# Altium project Sinus_Project.PrjPCB
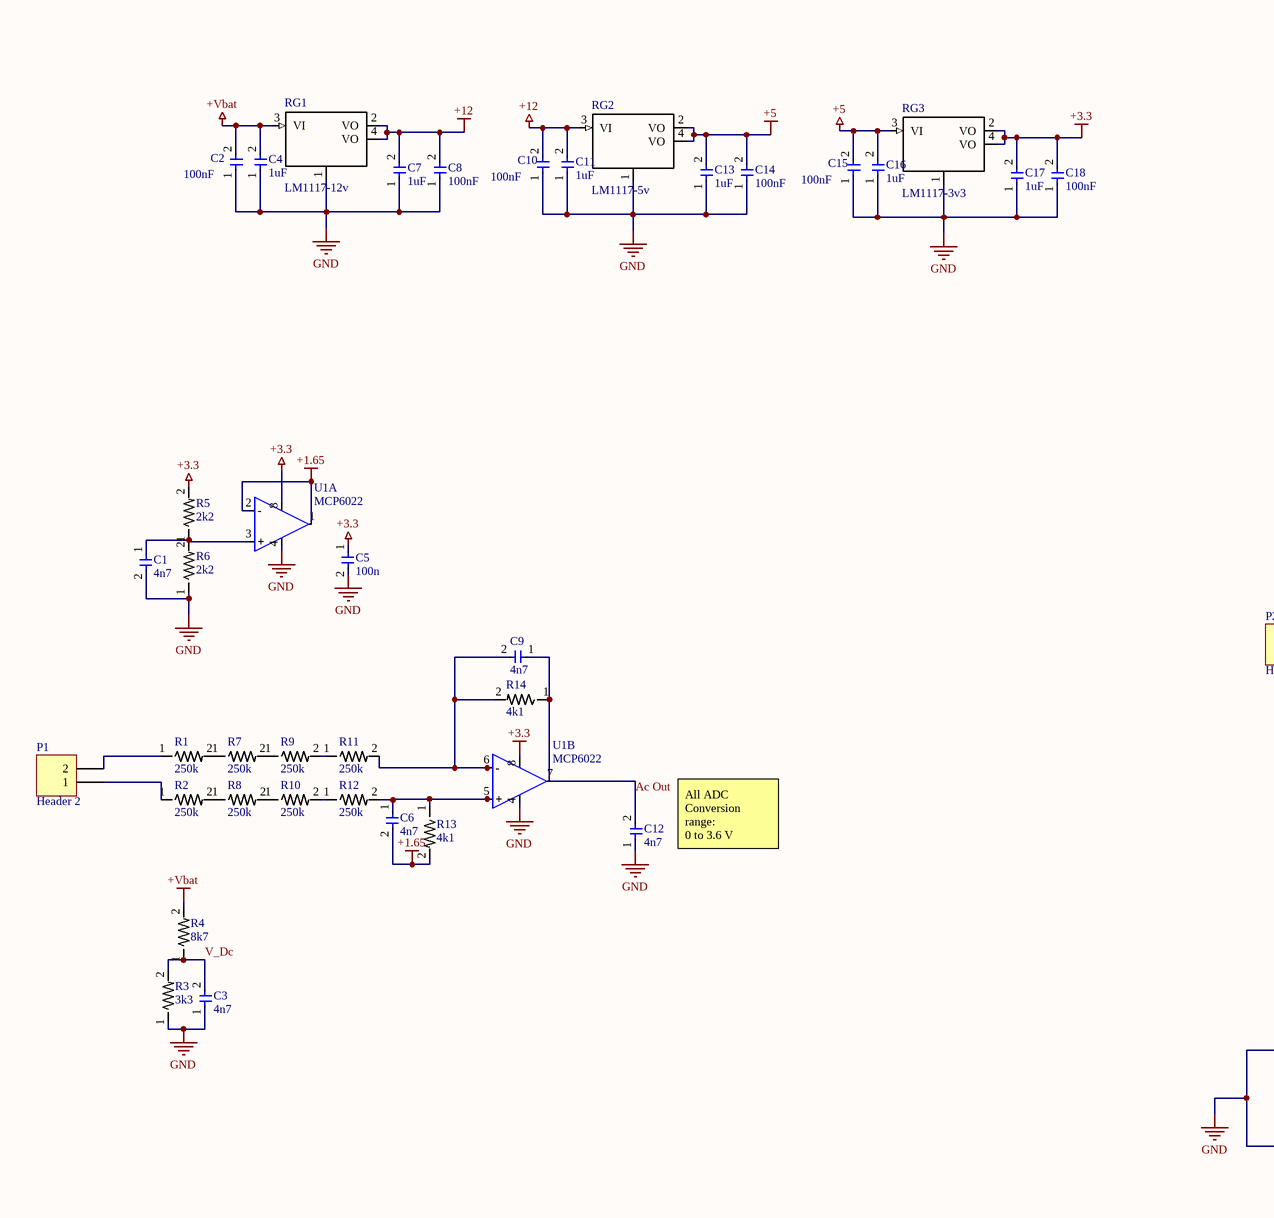
[diagram p0: pure_sinus.SchDoc, left]
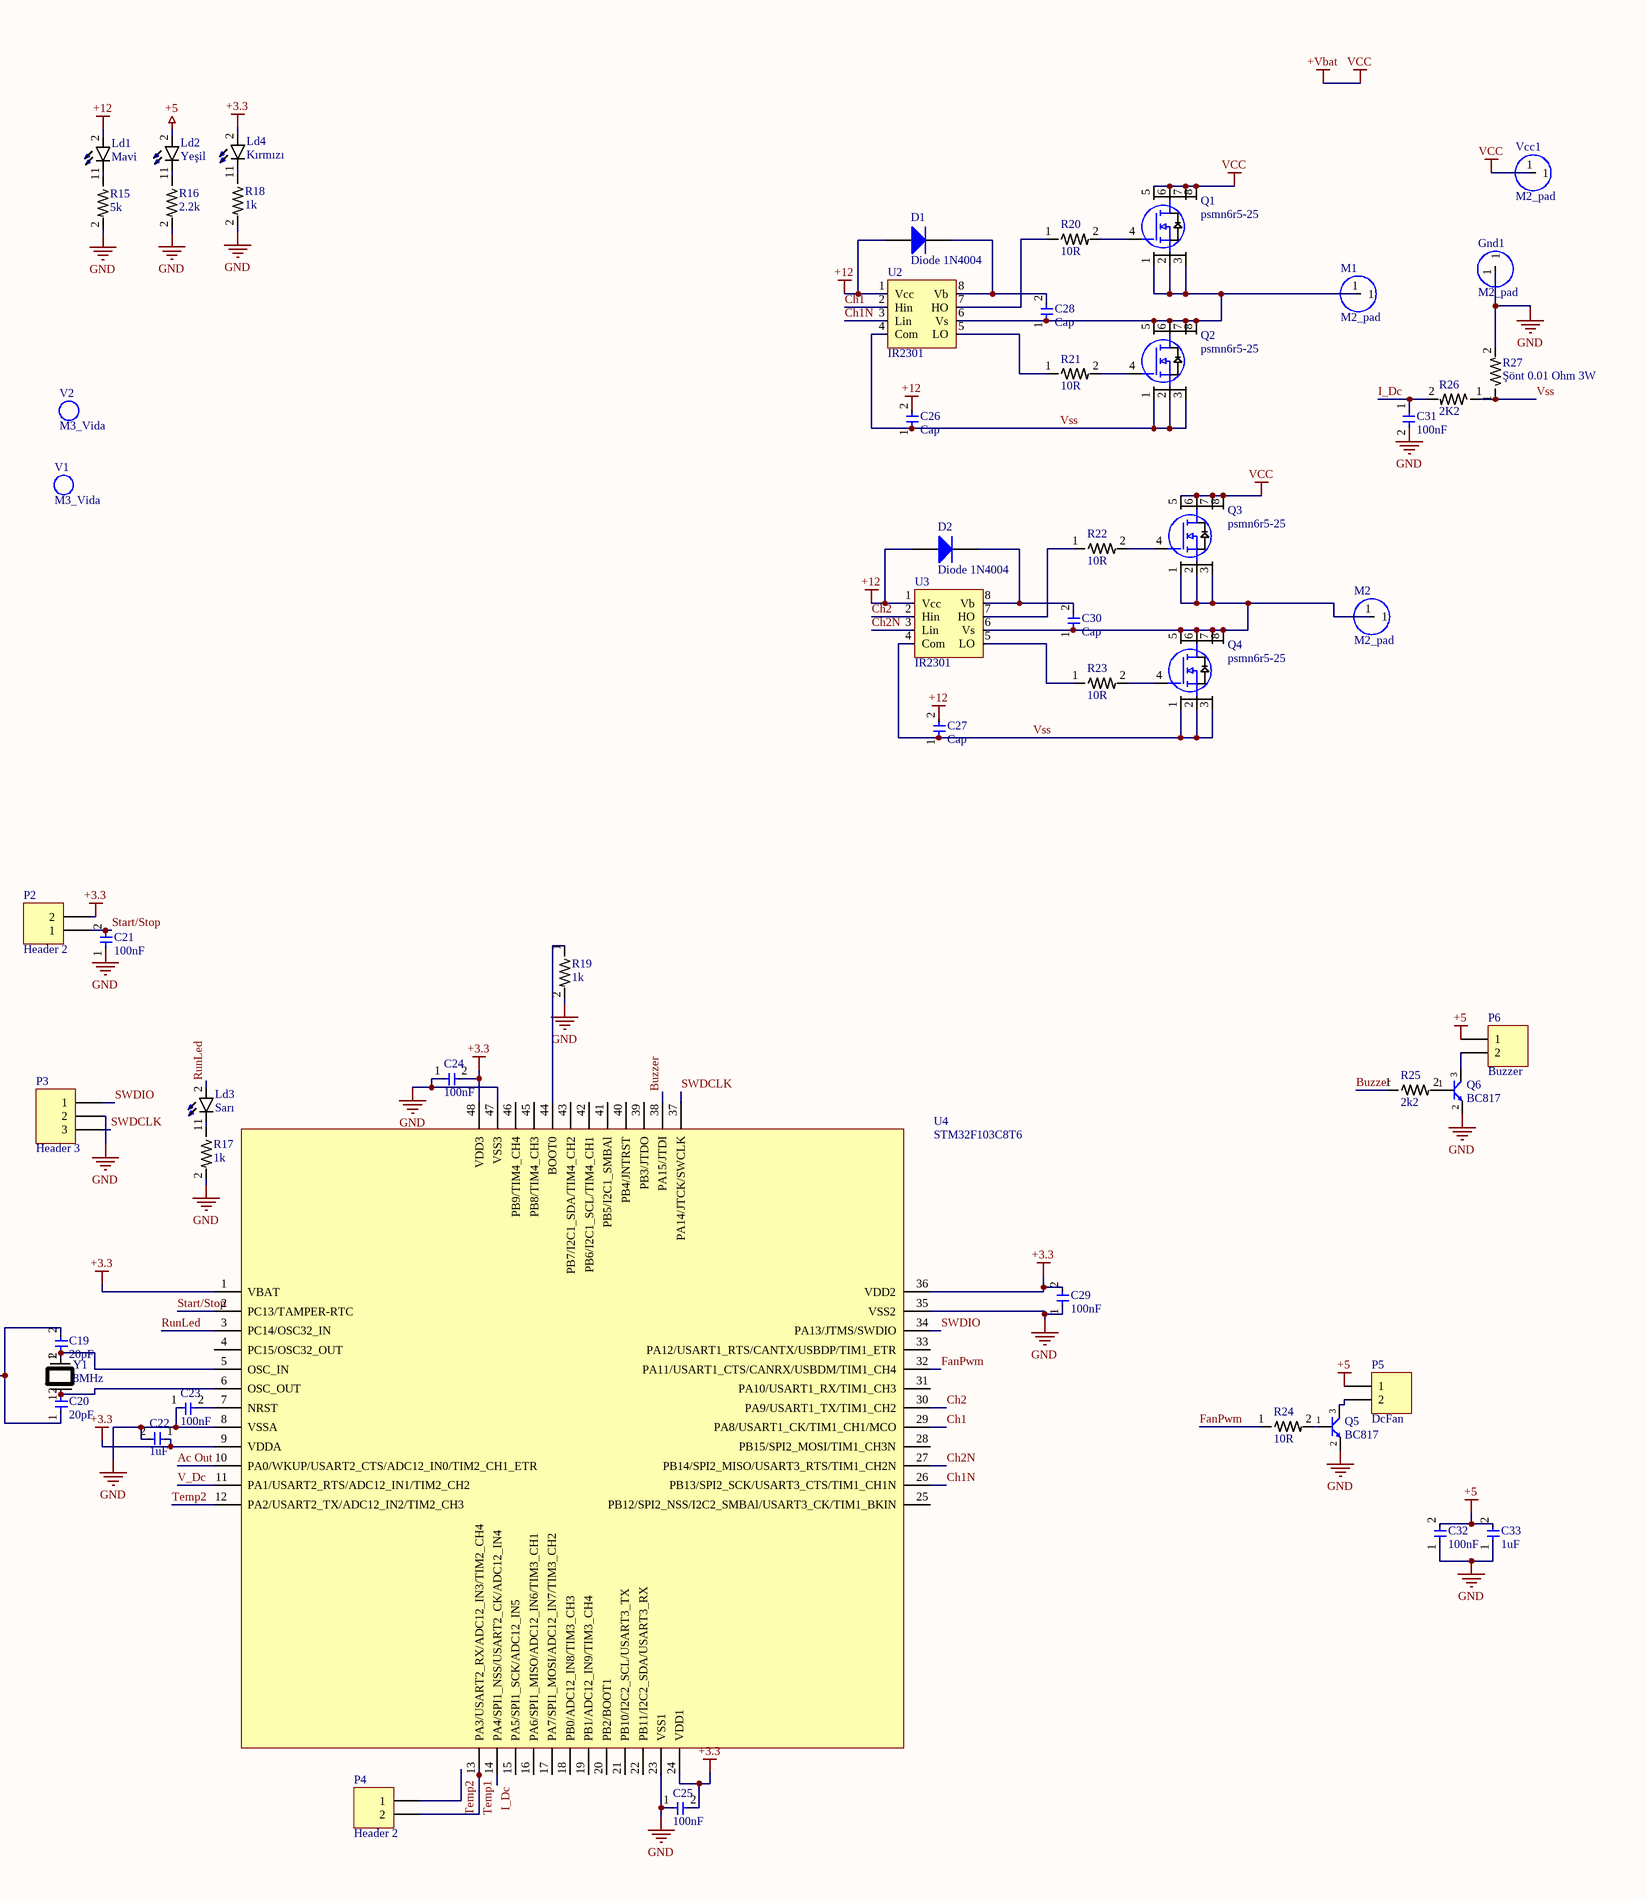
[diagram p1: pure_sinus.SchDoc, right]
1 sheet, 92 parts. Net scope: global (net labels, ports and power ports of the same name join across sheets).
Board file: pure_sinus.PcbDoc

## Sheet pure_sinus.SchDoc
size A2

### Parts
C1  4n7  [1206]
C2  100nF  [1206]
C3  4n7  [1206]
C4  1uF  [1206]
C5  100n  [1206]
C6  4n7  [1206]
C7  1uF  [1206]
C8  100nF  [1206]
C9  4n7  [1206]
C10  100nF  [1206]
C11  1uF  [1206]
C12  4n7  [1206]
C13  1uF  [1206]
C14  100nF  [1206]
C15  100nF  [1206]
C16  1uF  [1206]
C17  1uF  [1206]
C18  100nF  [1206]
C19  20pF  [1206]
C20  20pF  [1206]
C21  100nF  [1206]
C22  1uF  [1206]
C23  100nF  [1206]
C24  100nF  [1206]
C25  100nF  [1206]
C26  Cap  [1206]
C27  Cap  [1206]
C28  Cap  [1206]
C29  100nF  [1206]
C30  Cap  [1206]
C31  100nF  [C0805]
C32  100nF  [1206]
C33  1uF  [1206]
D1  Diode 1N4004  [SOD123]
D2  Diode 1N4004  [SOD123]
Gnd1  M2_pad  [M2_Pad]
Ld1  Mavi  [L1206]
Ld2  Yeşil  [L1206]
Ld3  Sarı  [L1206]
Ld4  Kırmızı  [L1206]
M1  M2_pad  [M2_Pad]
M2  M2_pad  [M2_Pad]
P1  Header 2  [2p_fml]
P2  Header 2  [2p_fml]
P3  Header 3  [HDR1X3]
P4  Header 2  [HDR1X2]
P5  DcFan  [HDR1X2]
P6  Buzzer  [HDR1X2]
Q1  psmn6r5-25  [power-so8]
Q2  psmn6r5-25  [power-so8]
Q3  psmn6r5-25  [power-so8]
Q4  psmn6r5-25  [power-so8]
Q5  BC817  [SOT23]
Q6  BC817  [SOT23]
R1  250k  [1206]
R2  250k  [1206]
R3  3k3  [0603]
R4  8k7  [0603]
R5  2k2  [1206]
R6  2k2  [1206]
R7  250k  [1206]
R8  250k  [1206]
R9  250k  [1206]
R10  250k  [1206]
R11  250k  [1206]
R12  250k  [1206]
R13  4k1  [1206]
R14  4k1  [1206]
R15  5k  [1206]
R16  2.2k  [1206]
R17  1k  [1206]
R18  1k  [1206]
R19  1k  [1206]
R20  10R  [0603]
R21  10R  [0603]
R22  10R  [0603]
R23  10R  [0603]
R24  10R  [1206]
R25  2k2  [1206]
R26  2K2  [0603]
R27  Şönt 0.01 Ohm 3W  [Shont_2512]
RG1  LM1117-12v  [SOT-223]
RG2  LM1117-5v  [SOT-223]
RG3  LM1117-3v3  [SOT-223]
U1  MCP6022  [SOP-8L]  (parts A,B of 2)
U2  IR2301  [SOP-8L]
U3  IR2301  [SOP-8L]
U4  STM32F103C8T6  [LQFP48]
V1  M3_Vida  [M3_Vida]
V2  M3_Vida  [M3_Vida]
Vcc1  M2_pad  [M2_Pad]
Y1  8MHz  [xtal]

### Nets
+1.65: C6.2 R13.2 U1.1(O1) U1.2(-)
+3.3: C5.1 C17.2 C18.2 C22.1 C24.2 C25.2 C29.2 Ld4.2 P2.2 R5.2 RG3.2(VO) RG3.4(VO) U1.8(Vdd) U4.1(VBAT) U4.9(VDDA) U4.24(VDD1) U4.36(VDD2) U4.48(VDD3)
+5: C13.2 C14.2 C15.2 C16.2 C32.2 C33.2 Ld2.2 P5.1 P6.1 RG2.2(VO) RG2.4(VO) RG3.3(VI)
+12: C7.2 C8.2 C10.2 C11.2 C26.2 C27.2 D1.1(A) D2.1(A) Ld1.2 RG1.2(VO) RG1.4(VO) RG2.3(VI) U2.1(Vcc) U3.1(Vcc)
+Vbat: C2.2 C4.2 Q1.5(Drain) Q1.6(Drain) Q1.7(Drain) Q1.8(Drain) Q3.5(Drain) Q3.6(Drain) Q3.7(Drain) Q3.8(Drain) R4.2 RG1.3(VI) Vcc1.1  [also labelled VCC]
GND: C1.2 C2.1 C3.1 C4.1 C5.2 C7.1 C8.1 C10.1 C11.1 C12.1 C13.1 C14.1 C15.1 C16.1 C17.1 C18.1 C19.2 C20.1 C21.1 C22.2 C23.1 C24.1 C25.1 C29.1 C31.2 C32.1 C33.1 Gnd1.1 P3.2 Q5.2(E) Q6.2(E) R3.1 R6.1 R15.2 R16.2 R17.2 R18.2 R19.2 R27.2 RG1.1(GND) RG2.1(GND) RG3.1(GND) U1.4(Vss) U4.8(VSSA) U4.23(VSS1) U4.35(VSS2) U4.47(VSS3)
Ac Out: C9.1 C12.2 R14.1 U1.7(O2) U4.10(PA0/WKUP/USART2_CTS/ADC12_IN0/TIM2_CH1_ETR)
Buzzer: R25.1 U4.38(PA15/JTDI)
Ch1: U2.2(Hin) U4.29(PA8/USART1_CK/TIM1_CH1/MCO)
Ch1N: U2.3(Lin) U4.26(PB13/SPI2_SCK/USART3_CTS/TIM1_CH1N)
Ch2: U3.2(Hin) U4.30(PA9/USART1_TX/TIM1_CH2)
Ch2N: U3.3(Lin) U4.27(PB14/SPI2_MISO/USART3_RTS/TIM1_CH2N)
FanPwm: R24.1 U4.32(PA11/USART1_CTS/CANRX/USBDM/TIM1_CH4)
I_Dc: C31.1 R26.2 U4.14(PA4/SPI1_NSS/USART2_CK/ADC12_IN4)
RunLed: Ld3.2 U4.3(PC14/OSC32_IN)
Start/Stop: C21.2 P2.1 U4.2(PC13/TAMPER-RTC)
SWDCLK: P3.3 U4.37(PA14/JTCK/SWCLK)
SWDIO: P3.1 U4.34(PA13/JTMS/SWDIO)
Temp1: P4.2 U4.13(PA3/USART2_RX/ADC12_IN3/TIM2_CH4)
Temp2: P4.1 U4.12(PA2/USART2_TX/ADC12_IN2/TIM2_CH3)
V_Dc: C3.2 R3.2 R4.1 U4.11(PA1/USART2_RTS/ADC12_IN1/TIM2_CH2)
Vss: C26.1 C27.1 Q2.1(Source) Q2.2(Source) Q2.3(Source) Q4.1(Source) Q4.2(Source) Q4.3(Source) R26.1 R27.1 U2.4(Com) U3.4(Com)
NetC1_1: C1.1 R5.1 R6.2 U1.3(+)
NetC6_1: C6.1 R12.2 R13.1 U1.5(+)
NetC9_2: C9.2 R11.2 R14.2 U1.6(-)
NetC19_1: C19.1 U4.5(OSC_IN) Y1.2
NetC20_2: C20.2 U4.6(OSC_OUT) Y1.1
NetC23_2: C23.2 U4.7(NRST)
NetC28_1: C28.1 M1.1 Q1.1(Source) Q1.2(Source) Q1.3(Source) Q2.5(Drain) Q2.6(Drain) Q2.7(Drain) Q2.8(Drain) U2.6(Vs)
NetC28_2: C28.2 D1.2(K) U2.8(Vb)
NetC30_1: C30.1 M2.1 Q3.1(Source) Q3.2(Source) Q3.3(Source) Q4.5(Drain) Q4.6(Drain) Q4.7(Drain) Q4.8(Drain) U3.6(Vs)
NetC30_2: C30.2 D2.2(K) U3.8(Vb)
NetLd1_1: Ld1.1(C) R15.1
NetLd2_1: Ld2.1(C) R16.1
NetLd3_1: Ld3.1(C) R17.1
NetLd4_1: Ld4.1(C) R18.1
NetP1_1: P1.1 R2.1
NetP1_2: P1.2 R1.1
NetP5_2: P5.2 Q5.3(C)
NetP6_2: P6.2 Q6.3(C)
NetQ1_4: Q1.4(Gate) R20.2
NetQ2_4: Q2.4(Gate) R21.2
NetQ3_4: Q3.4(Gate) R22.2
NetQ4_4: Q4.4(Gate) R23.2
NetQ5_1: Q5.1(B) R24.2
NetQ6_1: Q6.1(B) R25.2
NetR1_2: R1.2 R7.1
NetR2_2: R2.2 R8.1
NetR7_2: R7.2 R9.1
NetR8_2: R8.2 R10.1
NetR9_2: R9.2 R11.1
NetR10_2: R10.2 R12.1
NetR19_1: R19.1 U4.44(BOOT0)
NetR20_1: R20.1 U2.7(HO)
NetR21_1: R21.1 U2.5(LO)
NetR22_1: R22.1 U3.7(HO)
NetR23_1: R23.1 U3.5(LO)

Not connected (* = marked no-connect by the designer): U4 4(PC15/OSC32_OUT) 15(PA5/SPI1_SCK/ADC12_IN5) 16(PA6/SPI1_MISO/ADC12_IN6/TIM3_CH1) 17(PA7/SPI1_MOSI/ADC12_IN7/TIM3_CH2) 18(PB0/ADC12_IN8/TIM3_CH3) 19(PB1/ADC12_IN9/TIM3_CH4) 20(PB2/BOOT1) 21(PB10/I2C2_SCL/USART3_TX) 22(PB11/I2C2_SDA/USART3_RX) 25(PB12/SPI2_NSS/I2C2_SMBAl/USART3_CK/TIM1_BKIN) 28(PB15/SPI2_MOSI/TIM1_CH3N) 31(PA10/USART1_RX/TIM1_CH3) 33(PA12/USART1_RTS/CANTX/USBDP/TIM1_ETR) 39(PB3/JTDO) 40(PB4/JNTRST) 41(PB5/I2C1_SMBAl) 42(PB6/I2C1_SCL/TIM4_CH1) 43(PB7/I2C1_SDA/TIM4_CH2) 45(PB8/TIM4_CH3) 46(PB9/TIM4_CH4)

### Notes on the sheet
- (near C12) All ADC
  Conversion range:
  0 to 3.6 V

### Library data of the parts
C1-C25 C29 C31-C33 = Cap
D1 D2 = Diode 1N4004: 1 Amp General Purpose Rectifier; Published: 8-Jun-2000; LatestRevisionDate: 17-Jul-2002; LatestRevisionNote: Re-released for DXP Platform.; DatasheetVersion: 1998; PackageVersion: Aug-1999; PackageReference: DO-41; Publisher: Altium Limited; PackageDescription: Diode, Axial; Body 5.2 x 2.7 mm (LxDia. max), Lead Dia. 0.86 mm (max); Code_JEDEC: DO-204-AL; ComponentLink1Description: Manufacturer Link; ComponentLink1URL: http://www.fairchildsemi.com/; ComponentLink2Description: Datasheet; ComponentLink2URL: http://www.fairchildsemi.com/ds/1N%2F1N4001.pdf
Ld1-Ld4 = Led
P1 P2 P4-P6 = Header 2: Header, 2-Pin; LatestRevisionDate: 17-Jul-2002; LatestRevisionNote: Re-released for DXP Platform.; Publisher: Altium Limited
P3 = Header 3: Header, 3-Pin; LatestRevisionDate: 17-Jul-2002; LatestRevisionNote: Re-released for DXP Platform.; Publisher: Altium Limited
Q5 Q6 = BC817: 45 V, 500 mA NPN general-purpose transistors; Supplier 1: Farnell; Supplier Part Number 1: 1459035RL
R1-R26 = Resistor
R27 = Resistor: 0.01 Ohm / 3W
RG1-RG3 = LM1117
Y1 = Xtal